# Altium schematic sheet FiltroRF.SchDoc
size A4
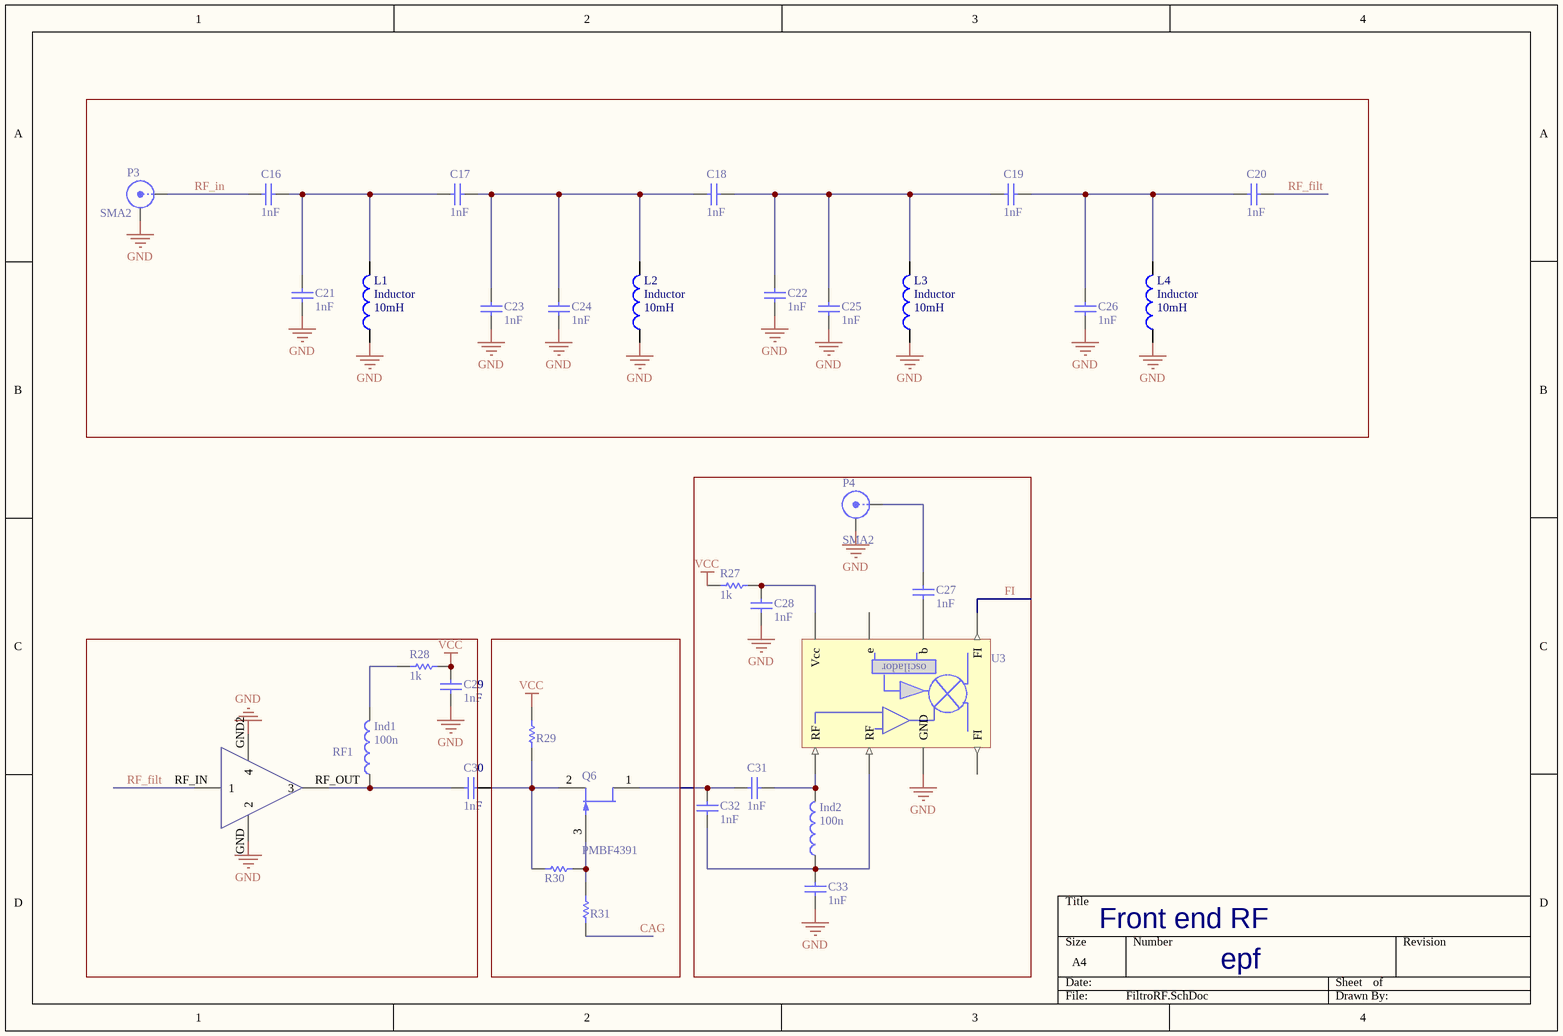
[diagram p0: FiltroRF.SchDoc]

## Parts
C16  value 1nF  [0805_CAP]  (hidden comment: Capacitor)
C17  value 1nF  [0805_CAP]  (hidden comment: Capacitor)
C18  value 1nF  [0805_CAP]  (hidden comment: Capacitor)
C19  value 1nF  [0805_CAP]  (hidden comment: Capacitor)
C20  value 1nF  [0805_CAP]  (hidden comment: Capacitor)
C21  value 1nF  [0805_CAP]  (hidden comment: Capacitor)
C22  value 1nF  [0805_CAP]  (hidden comment: Capacitor)
C23  value 1nF  [0805_CAP]  (hidden comment: Capacitor)
C24  value 1nF  [0805_CAP]  (hidden comment: Capacitor)
C25  value 1nF  [0805_CAP]  (hidden comment: Capacitor)
C26  value 1nF  [0805_CAP]  (hidden comment: Capacitor)
C27  value 1nF  [0805_CAP]  (hidden comment: Capacitor)
C28  value 1nF  [0805_CAP]  (hidden comment: Capacitor)
C29  value 1nF  [0805_CAP]  (hidden comment: Capacitor)
C30  value 1nF  [0805_CAP]  (hidden comment: Capacitor)
C31  value 1nF  [0805_CAP]  (hidden comment: Capacitor)
C32  value 1nF  [0805_CAP]  (hidden comment: Capacitor)
C33  value 1nF  [0805_CAP]  (hidden comment: Capacitor)
Ind1  Valor: 100n  [NTH12_2]  (hidden comment: Ind2)
Ind2  Valor: 100n  [Ind_3mm]  (hidden comment: Ind2)
L1  Inductor  value 10mH  [INDC3216AL]
L2  Inductor  value 10mH  [INDC3216AL]
L3  Inductor  value 10mH  [INDC3216AL]
L4  Inductor  value 10mH  [INDC3216AL]
P3  SMA2  [SMAL_Antena]
P4  SMA2  [SMAL2]
Q6  PMBF4391  [SOT23]
R27  value 1k  [0805_RES]  (hidden comment: Resistor)
R28  value 1k  [0805_RES]  (hidden comment: Resistor)
R29  Resistor  [0805_RES]  (value not drawn)
R30  Resistor  [0805_RES]  (value not drawn)
R31  Resistor  [0805_RES]  (value not drawn)
RF1  MAR-1SM  [WW107]  (value not drawn)
U3  SA602  [SO-8_2]  (value not drawn)

## Nets
GND: C21.2 C22.1 C23.1 C24.1 C25.1 C26.2 C28.1 C29.1 C33.2 L1.1 L2.1 L3.1 L4.1 P3.0(Y) P4.0(Y) RF1.GND(2) RF1.GND2(4) U3.3(GND)
VCC: C29.2 R27.1 R28.2 R29.1
CAG: R31.1
FI: U3.5(FI)
RF_filt: C20.1 RF1.RF_IN(1)
RF_in: C16.2 P3.1(X)
NetC16_1: C16.1 C17.2 C21.1 L1.2
NetC17_1: C17.1 C18.1 C23.2 C24.2 L2.2
NetC18_2: C18.2 C19.1 C22.2 C25.2 L3.2
NetC19_2: C19.2 C20.2 C26.1 L4.2
NetC27_1: C27.1 U3.6(b)
NetC27_2: C27.2 P4.1(X)
NetC28_2: C28.2 R27.2 U3.8(Vcc)
NetC30_1: C30.1 Q6.2(S) R29.2 R30.2
NetC30_2: C30.2 Ind1.1 RF1.RF_OUT(3)
NetC31_1: C31.1 Ind2.2 U3.1(RF)
NetC31_2: C31.2 C32.1 Q6.1(D)
NetC32_2: C32.2 C33.1 Ind2.1 U3.2(RF)
NetInd1_2: Ind1.2 R28.1
NetQ6_3: Q6.3(G) R30.1 R31.2

Not connected (* = marked no-connect by the designer): U3 4(FI) 7(e)

## Notes on the sheet
- Front end RF
- epf
- (in symbol SA602A) oscilador

## Library data of the parts
C16-C33 = Cap
L1-L4 = Inductor: Code_IEC: 1005; Published: 8-Jun-2000; LatestRevisionDate: 29-May-2009; LatestRevisionNote: IPC-7351 Footprint Added.; PackageReference: 0402-A; Publisher: Altium Limited; PackageDescription: Chip Inductor; Code_JEITA: 0402
P3 P4 = SMA2: BNC Elbow Connector; LatestRevisionDate: 17-Jul-2002; LatestRevisionNote: Re-released for DXP Platform.; Publisher: Altium Limited
Q6 = PMBF4391: N-channel Silicon Junction Field-effect Transistor; Published: 17-Sep-2003; LatestRevisionDate: 12-Dec-2006; LatestRevisionNote: IPC-7351 Footprint Added.; DatasheetVersion: Apr-1995; PackageVersion: May-1999; PackageReference: SOT23; Publisher: Altium Limited; PackageDescription: 3-Pin SOT-23 Package 0.95 mm Pitch, 2.3 mm Lead Span; ComponentLink1Description: Manufacturer Link; ComponentLink1URL: http://www.semiconductors.philips.com/; ComponentLink2Description: Datasheet; ComponentLink2URL: http://www.semiconductors.philips.com/acrobat/datasheets/PMBF4391_4392_4393_CNV_2.pdf
R27-R31 = Res
RF1 = MAR-1SM: pin to pad: GND>2 GND2>4 RF_IN>1 RF_OUT>3
U3 = SA602A: Mezclador 500MHz